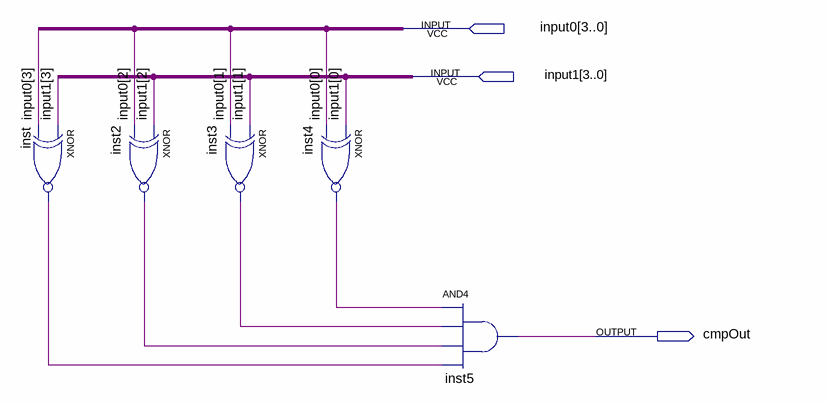
[diagram p0: schematic sheet]
// Quartus schematic EqCmp4.bdf as structural Verilog: 5 symbols, 3 pins
module EqCmp4 (
  input  [3:0] input0,
  input  [3:0] input1,
  output cmpOut
);

  wire inst2_out, inst3_out, inst4_out, inst_out;

  xnor inst (inst_out, input1[3], input0[3]);
  xnor inst2 (inst2_out, input1[2], input0[2]);
  xnor inst3 (inst3_out, input1[1], input0[1]);
  xnor inst4 (inst4_out, input1[0], input0[0]);
  and inst5 (cmpOut, inst4_out, inst3_out, inst2_out, inst_out);
endmodule
